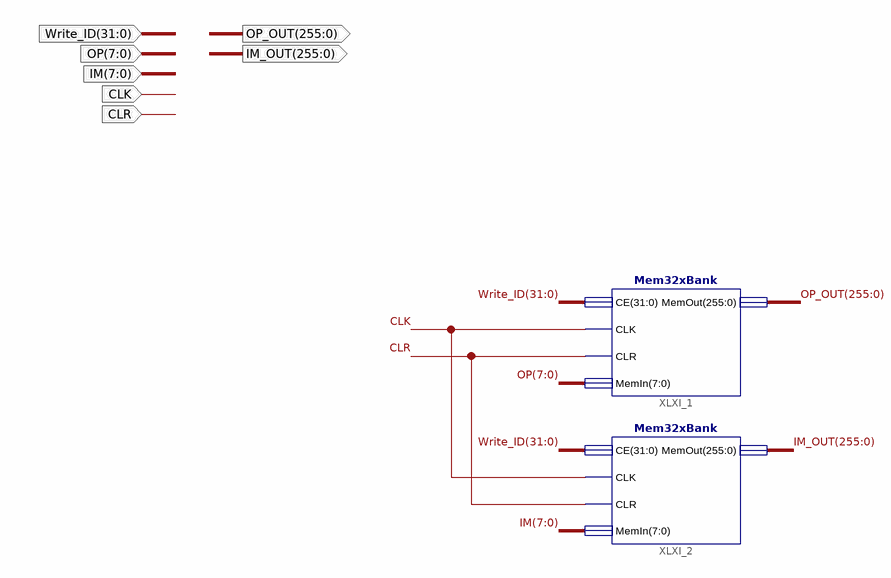
[diagram p0: schematic sheet 1]
// Xilinx ISE schematic MainMemory.sch (spartan3e) as structural Verilog: 2 symbols, 7 ports
module MainMemory (
  input  [7:0] OP,
  input  [7:0] IM,
  input  [31:0] Write_ID,
  input  CLR,
  input  CLK,
  output [255:0] OP_OUT,
  output [255:0] IM_OUT
);

  Mem32xBank XLXI_1 (.CE(Write_ID), .CLK(CLK), .CLR(CLR), .MemIn(OP), .MemOut(OP_OUT));
  Mem32xBank XLXI_2 (.CE(Write_ID), .CLK(CLK), .CLR(CLR), .MemIn(IM), .MemOut(IM_OUT));
endmodule
